# EasyEDA schematic SCH_breakout board for servo_2022-09-03.json
TITLE: Sheet_1; REV: 1.0; Date: 2022-06-12; Sheet: 1/1; Drawn By: alan Van de Glind; Company: Your Company
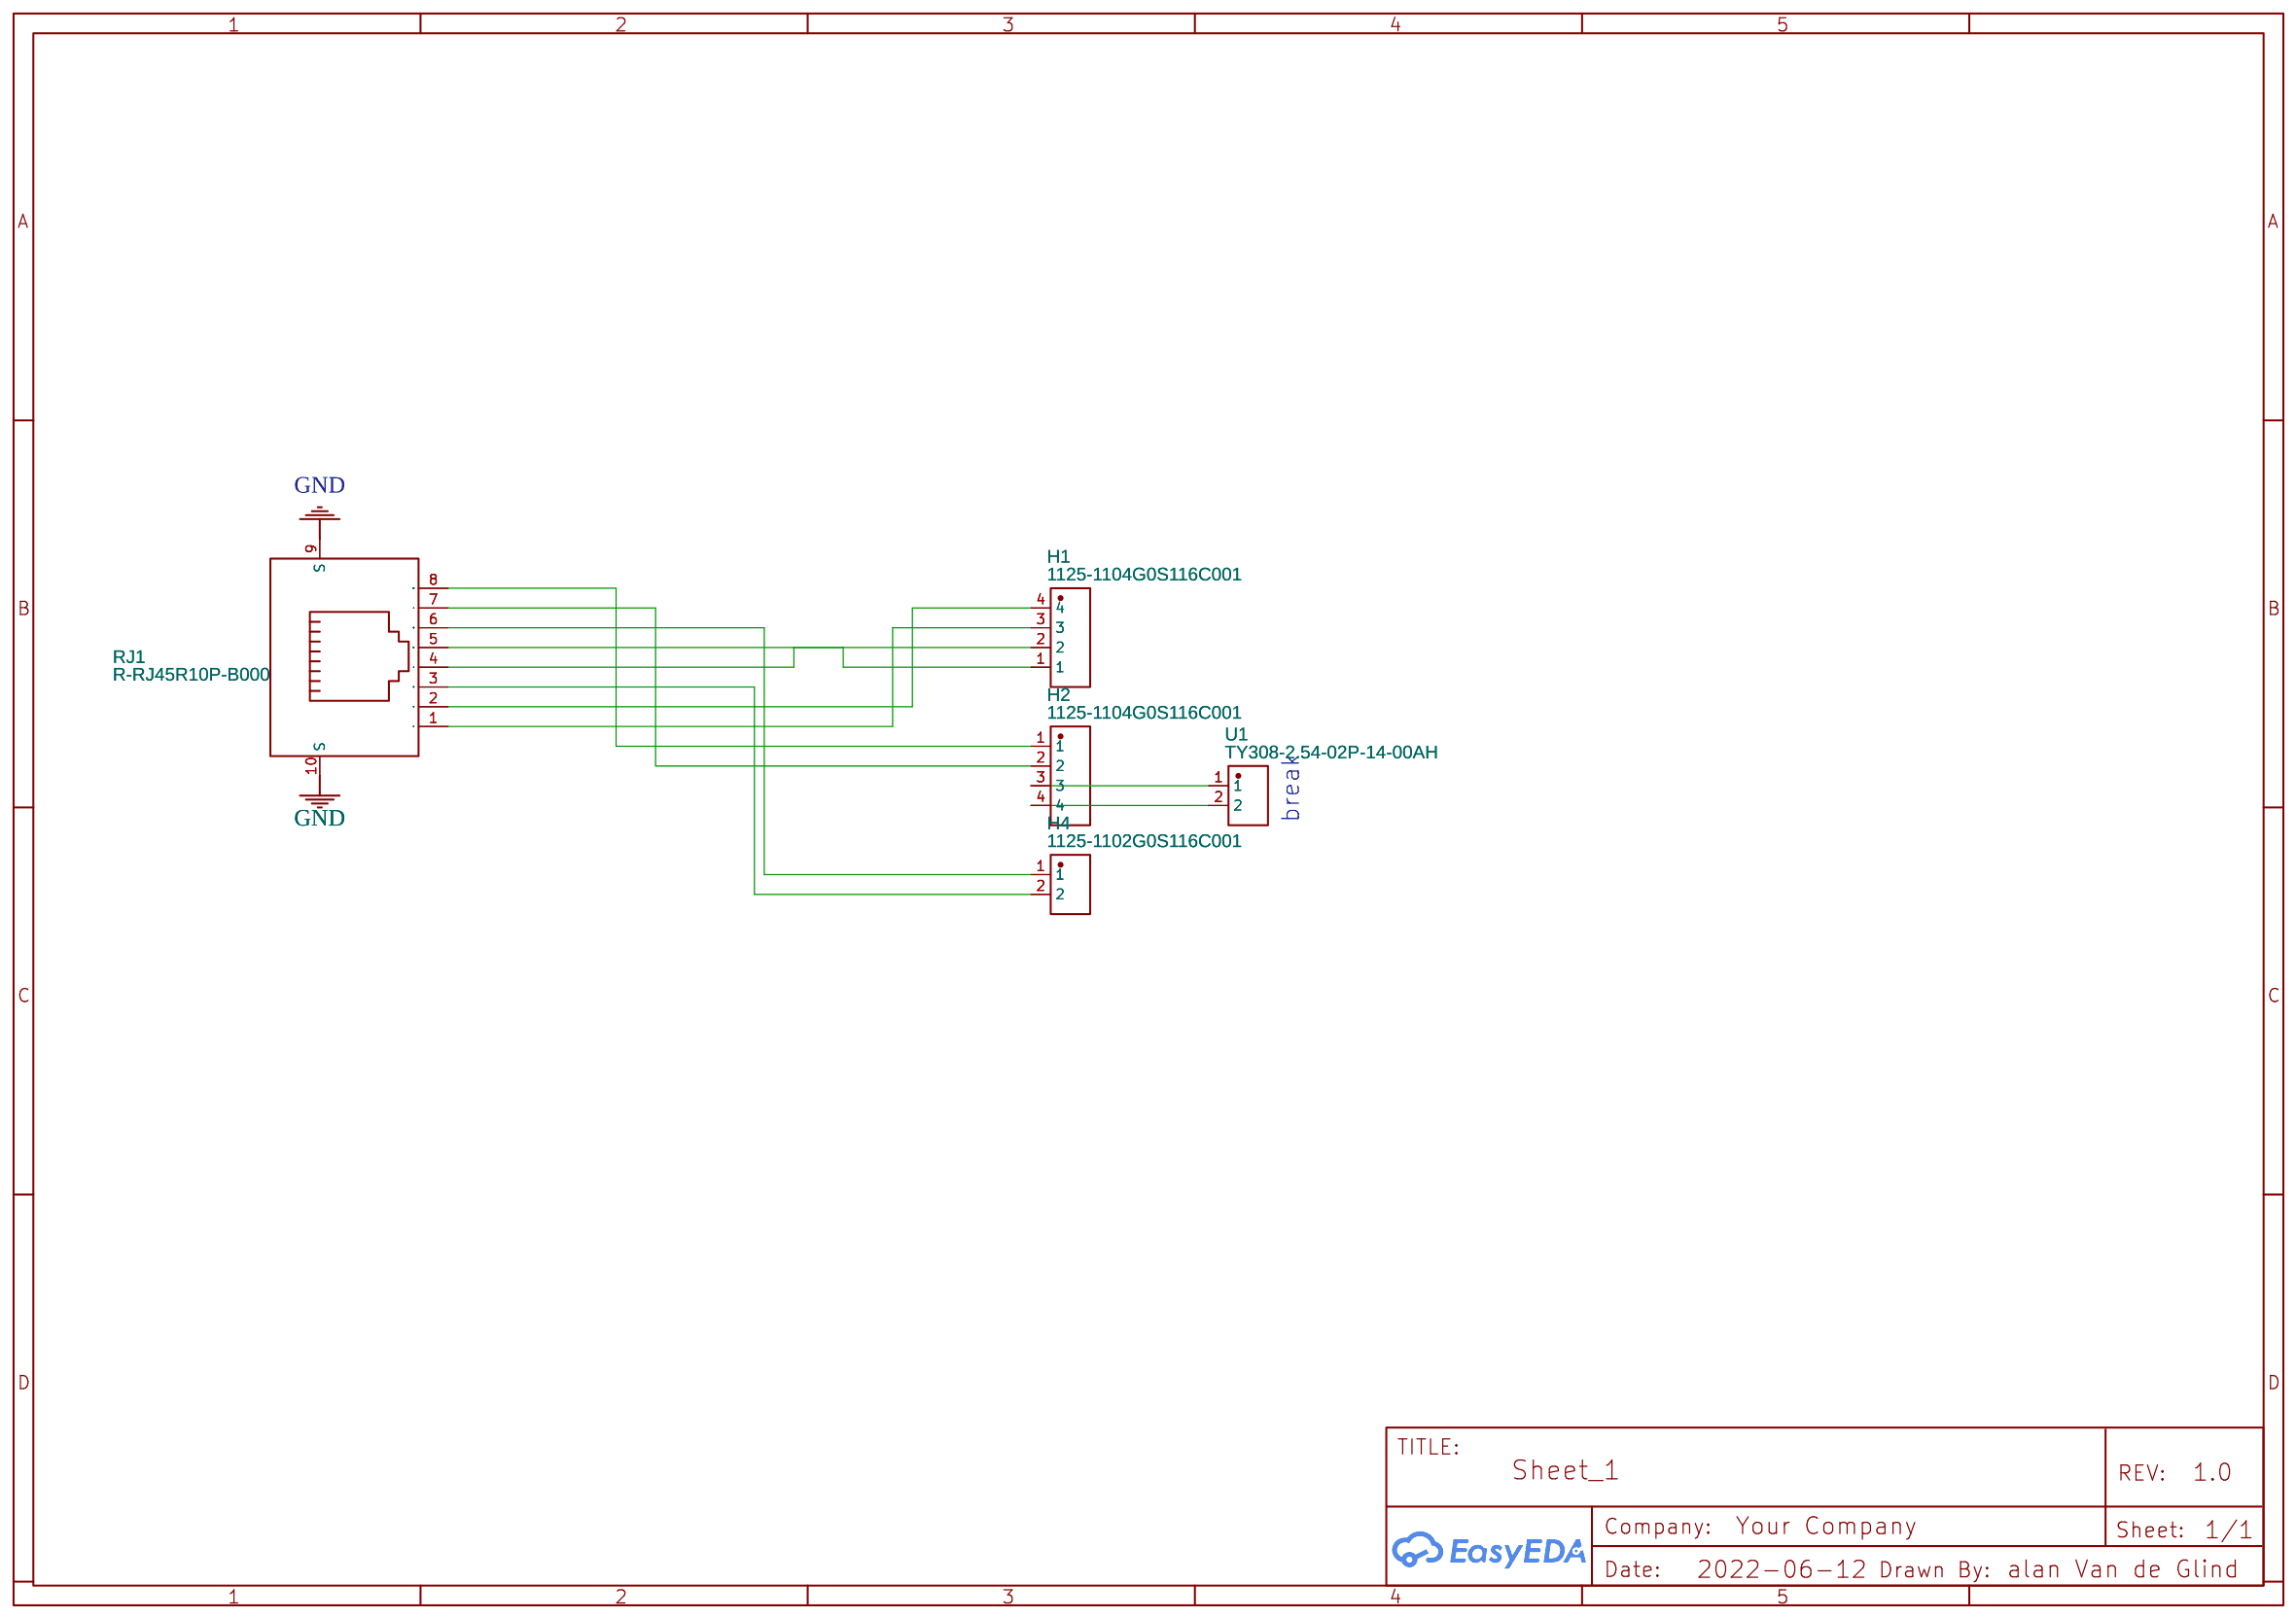
[diagram p0: schematic sheet]

## Parts
H1  1125-1104G0S116C001  [HDR-TH_4P-P2.54-V-M-1]
H2  1125-1104G0S116C001  [HDR-TH_4P-P2.54-V-M-1]
H4  1125-1102G0S116C001  [HDR-TH_2P-P2.54-V-M]
RJ1  R-RJ45R10P-B000  [RJ45-TH_R-RJ45R10P-B000]
U1  TY308-2.54-02P-14-00AH  [CONN-TH_2P-P2.54_TOPONELEC_TY308-2.54-02P-14-00AH]

## Library data of the parts
H1 H2 = 1125-1104G0S116C001: Supplier: LCSC; Supplier Part: C920779; Manufacturer: Wcon(维峰电子); Contributor: LCSC; JLCPCB Part Class: Extended Part
H4 = 1125-1102G0S116C001: Supplier: LCSC; Supplier Part: C920781; Manufacturer: Wcon(维峰电子); Contributor: LCSC
RJ1 = R-RJ45R10P-B000: Supplier: LCSC; Supplier Part: C386758; Manufacturer: Shenzhen Cankemeng; Contributor: LCSC; JLCPCB Part Class: Extended Part
U1 = TY308-2.54-02P-14-00AH: Supplier: LCSC; Supplier Part: C2840316; Manufacturer: Toponelec(拓宜); Contributor: LCSC; JLCPCB Part Class: Extended Part

## Nets
GND: RJ1.9(S) RJ1.10(S)
Net-(H1-1): H1.1 RJ1.5
Net-(H1-2): H1.2 RJ1.4
Net-(H1-3): H1.3 RJ1.1
Net-(H1-4): H1.4 RJ1.2
Net-(H2-1): H2.1 RJ1.8
Net-(H2-2): H2.2 RJ1.7
Net-(H2-3): H2.3 U1.1
Net-(H2-4): H2.4 U1.2
Net-(H4-1): H4.1 RJ1.6
Net-(H4-2): H4.2 RJ1.3

## Notes on the sheet
- break
